# Altium schematic sheet ethernet_module.SchDoc: LPC1768
size 298 x 212 mm; Date: 31.05.2016 15:06:27; SheetNumber: 4
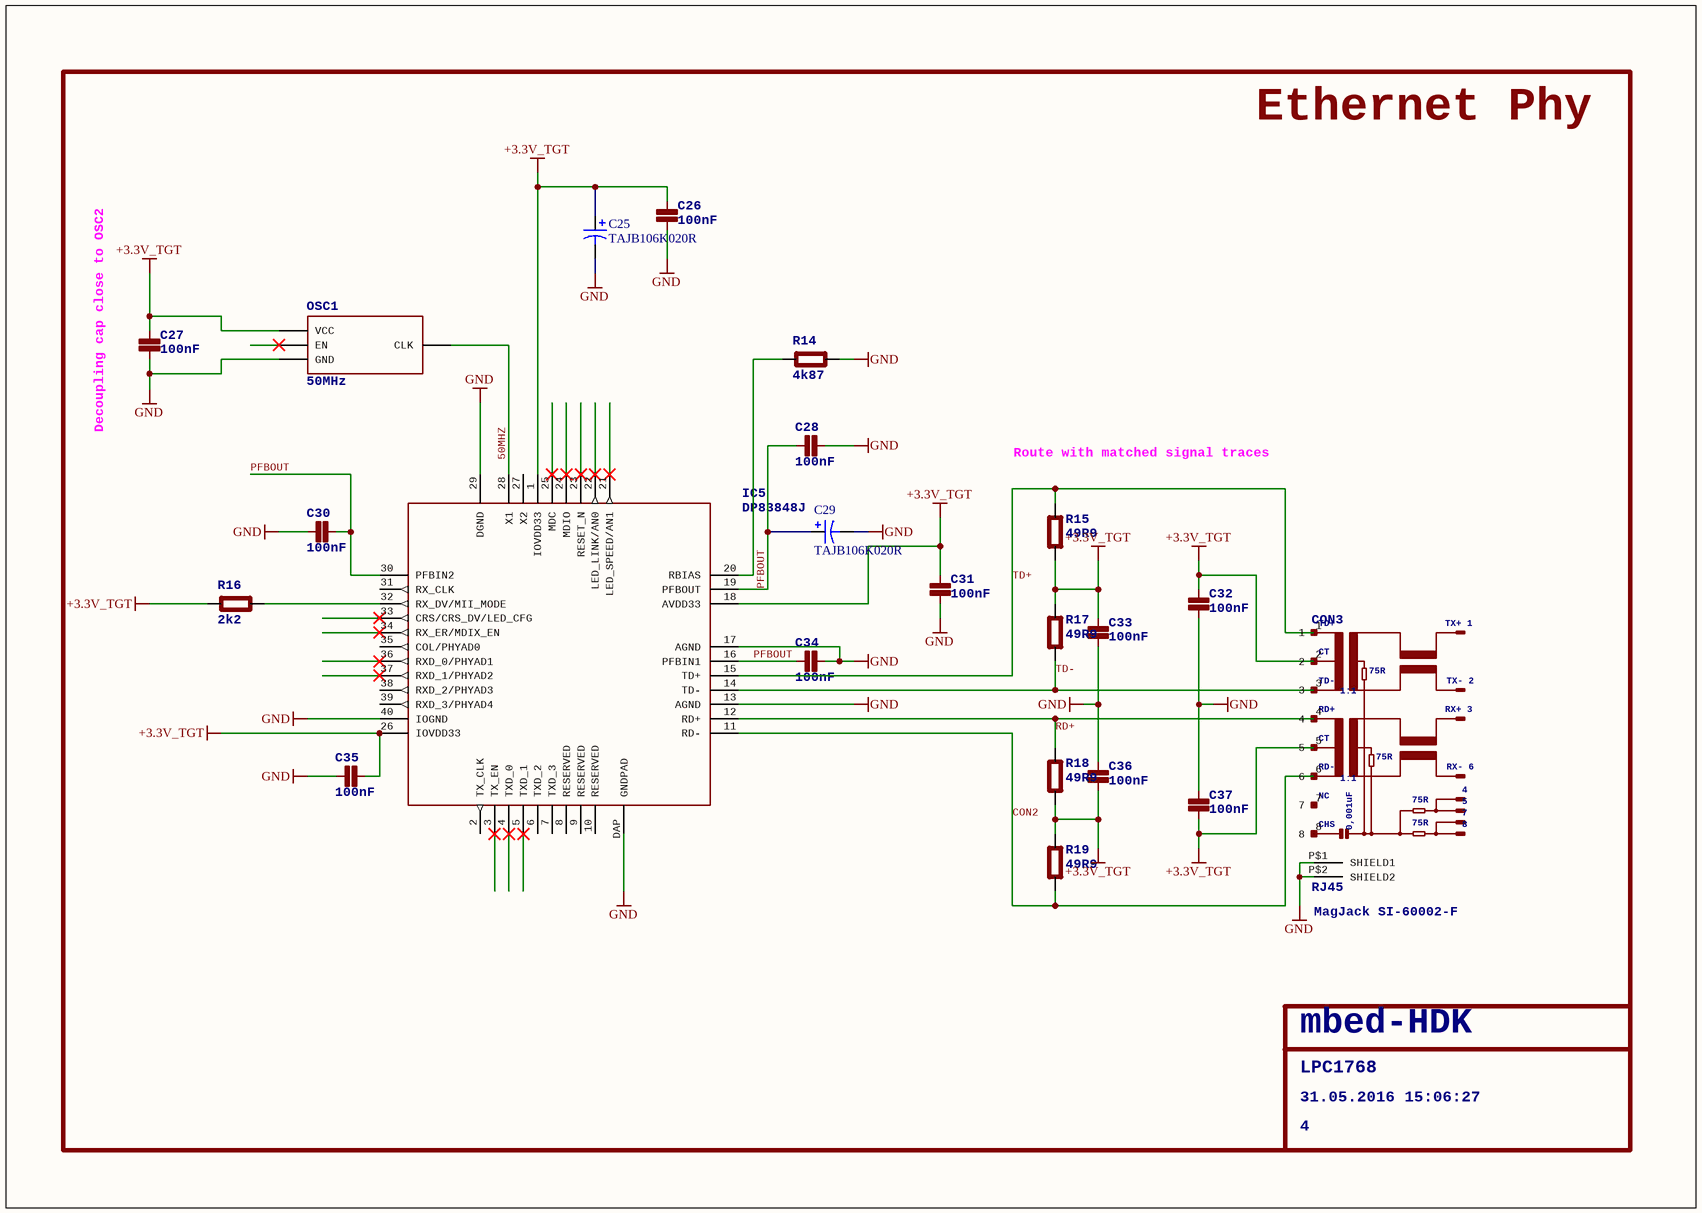
[diagram p0: ethernet_module.SchDoc]

## Parts
C25  TAJB106K020R  [AVX-CAPC3528_V]
C26  100nF  [0603]
C27  100nF  [0603]
C28  100nF  [0603]
C29  TAJB106K020R  [AVX-CAPC3528_V]
C30  100nF  [0603]
C31  100nF  [0603]
C32  100nF  [0603]
C33  100nF  [0603]
C34  100nF  [0603]
C35  100nF  [0603]
C36  100nF  [0603]
C37  100nF  [0603]
CON3  RJ45  RX+3: RX+ 3  TX-2: TX- 2  TX+1: TX+ 1  RX-6: RX- 6  MagJackSI-60002-F: MagJack SI-60002-F  [RJ45]
IC5  DP83848J  [LLP-40]
OSC1  50MHz  [3.2X.2.5]
R14  4k87  [0603]
R15  49R9  [0603]
R16  2k2  [0603]
R17  49R9  [0603]
R18  49R9  [0603]
R19  49R9  [0603]

## Nets
+3.3V_TGT: C25.1 C26.1(P$1) C27.1(P$1) C31.1(P$1) C32.1(P$1) C33.1(P$1) C35.1(P$1) C36.2(P$2) C37.2(P$2) CON3.2 CON3.5 IC5.1(IOVDD33) IC5.18(AVDD33) IC5.26(IOVDD33) OSC1.P$4(VCC) R15.1(P$1) R16.1(P$1) R17.2(P$2) R18.1(P$1) R19.2(P$2)
GND: C25.2 C26.2(P$2) C27.2(P$2) C28.1(P$1) C29.2 C30.1(P$1) C31.2(P$2) C32.2(P$2) C33.2(P$2) C34.2(P$2) C35.2(P$2) C36.1(P$1) C37.1(P$1) CON3.P$1(SHIELD1) CON3.P$2(SHIELD2) IC5.13(AGND) IC5.17(AGND) IC5.29(DGND) IC5.40(IOGND) IC5.DAP(GNDPAD) OSC1.P$2(GND) R14.1(P$1)
50MHZ: IC5.28(X1) OSC1.P$3(CLK)
CON2: CON3.6 IC5.11(RD-) R19.1(P$1)
PFBOUT: C28.2(P$2) C29.1 C30.2(P$2) C34.1(P$1) IC5.16(PFBIN1) IC5.19(PFBOUT) IC5.30(PFBIN2)
RD+: CON3.4 IC5.12(RD+) R18.2(P$2)
TD+: CON3.1 IC5.15(TD+) R15.2(P$2)
TD-: CON3.3 IC5.14(TD-) R17.1(P$1)
NetIC5_20: IC5.20(RBIAS) R14.2(P$2)
NetIC5_32: IC5.32(RX_DV/MII_MODE) R16.2(P$2)

Not connected (* = marked no-connect by the designer): CON3 7 8; IC5 2(TX_CLK) 3(TX_EN)* 4(TXD_0)* 5(TXD_1)* 6(TXD_2) 7(TXD_3) 8(RESERVED) 9(RESERVED) 10(RESERVED) 21(LED_SPEED/AN1)* 22(LED_LINK/AN0)* 23(RESET_N)* 24(MDIO)* 25(MDC)* 27(X2) 31(RX_CLK) 33(CRS/CRS_DV/LED_CFG)* 34(RX_ER/MDIX_EN)* 35(COL/PHYAD0) 36(RXD_0/PHYAD1)* 37(RXD_1/PHYAD2)* 38(RXD_2/PHYAD3) 39(RXD_3/PHYAD4); OSC1 P$1(EN)*

## Notes on the sheet
- Ethernet Phy
- (near C27) Decoupling cap close to OSC2
- (near R15) Route with matched signal traces
- LPC1768
- mbed-HDK
- 31.05.2016 15:06:27
- 4

## Library data of the parts
C25 C29 = CMP-0279-00001-1: Capacitor, Tantalum, 10uF 10% 20V MCCT-B (3528); Manufacturer: AVX; Polarity: Polarized; PartNumber: TAJB106K020R; PackageDescription: 2-Pin SMT Capacitor, 3.5 x 2.8 mm Body; ComponentLink1URL: http://www.avx.com/; PackageReference: CAPC3528; ComponentLink2Description: Datasheet; Capacitance: 10uF; Technology: Tantalum; ComponentLink2URL: http://www.avx.com/docs/Catalogs/taj.pdf; Tolerance: 10%; ComponentLink1Description: Manufacturer URL; Rated Voltage: 20V; DatasheetVersion: Jun-13; Mounting Technology: Surface Mount
C26-C28 C30-C37 = C0603
CON3 = RJ45: Magjack SI-68002; 75R: 75R; TD+: TD+; CT: CT; TD-: TD-; RD+: RD+; RD-: RD-; NC: NC; CHS: CHS; 0,001uF: 0,001uF; 4: 4; 5: 5; 7: 7; 8: 8; 1:1: 1:1
IC5 = DP83848J: National Semiconductor DP83848J PHYTER Mini LS Single Port 10/100 Ethernet Transceiver
OSC1 = OSCILLATOR
R14-R19 = R0603